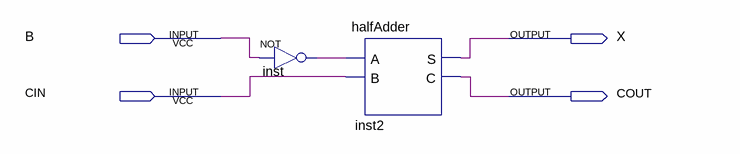
[diagram p0: schematic sheet]
// Quartus schematic twosComplement1Bit.bdf as structural Verilog: 2 symbols, 4 pins
module twosComplement1Bit (
  input  B,
  input  CIN,
  output X,
  output COUT
);

  wire inst_out;

  not inst (inst_out, B);
  halfAdder inst2 (.A(inst_out), .B(CIN), .S(X), .C(COUT));
endmodule
